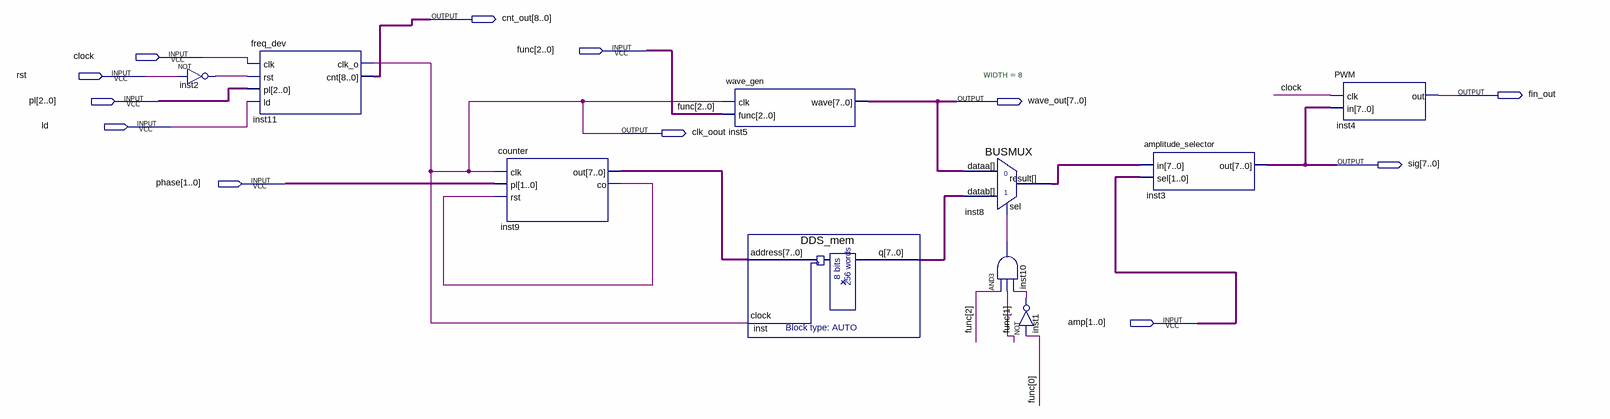
[diagram p0: schematic sheet]
// Quartus schematic LAB3.bdf as structural Verilog: 10 symbols, 12 pins
module LAB3 (
  input  [2:0] func,
  input  clock,
  input  rst,
  input  [2:0] pl,
  input  ld,
  input  [1:0] phase,
  input  [1:0] amp,
  output [8:0] cnt_out,
  output fin_out,
  output [7:0] wave_out,
  output clk_oout,
  output [7:0] sig
);

  wire inst1_out, inst2_out, inst9_co, inst10_out;
  wire [7:0] inst8_result, inst9_out, inst_q;

  not inst2 (inst2_out, rst);
  freq_dev inst11 (.clk(clock), .rst(inst2_out), .pl(pl), .ld(ld), .clk_o(clk_oout), .cnt(cnt_out));
  counter inst9 (.clk(clk_oout), .pl(phase), .rst(inst9_co), .out(inst9_out), .co(inst9_co));
  wave_gen inst5 (.clk(clk_oout), .func(func), .wave(wave_out));
  DDS_mem inst (.address(inst9_out), .clock(clk_oout), .q(inst_q));
  BUSMUX #(.WIDTH(8)) inst8 (.datab(inst_q), .sel(inst10_out), .dataa(wave_out), .result(inst8_result));
  and inst10 (inst10_out, func[2], func[1], inst1_out);
  not inst1 (inst1_out, func[0]);
  amplitude_selector inst3 (.in(inst8_result), .sel(amp), .out(sig));
  PWM inst4 (.clk(clock), .in(sig), .out(fin_out));
endmodule
